# EAGLE schematic traffic_lights_usb (EAGLE 7.4.0)
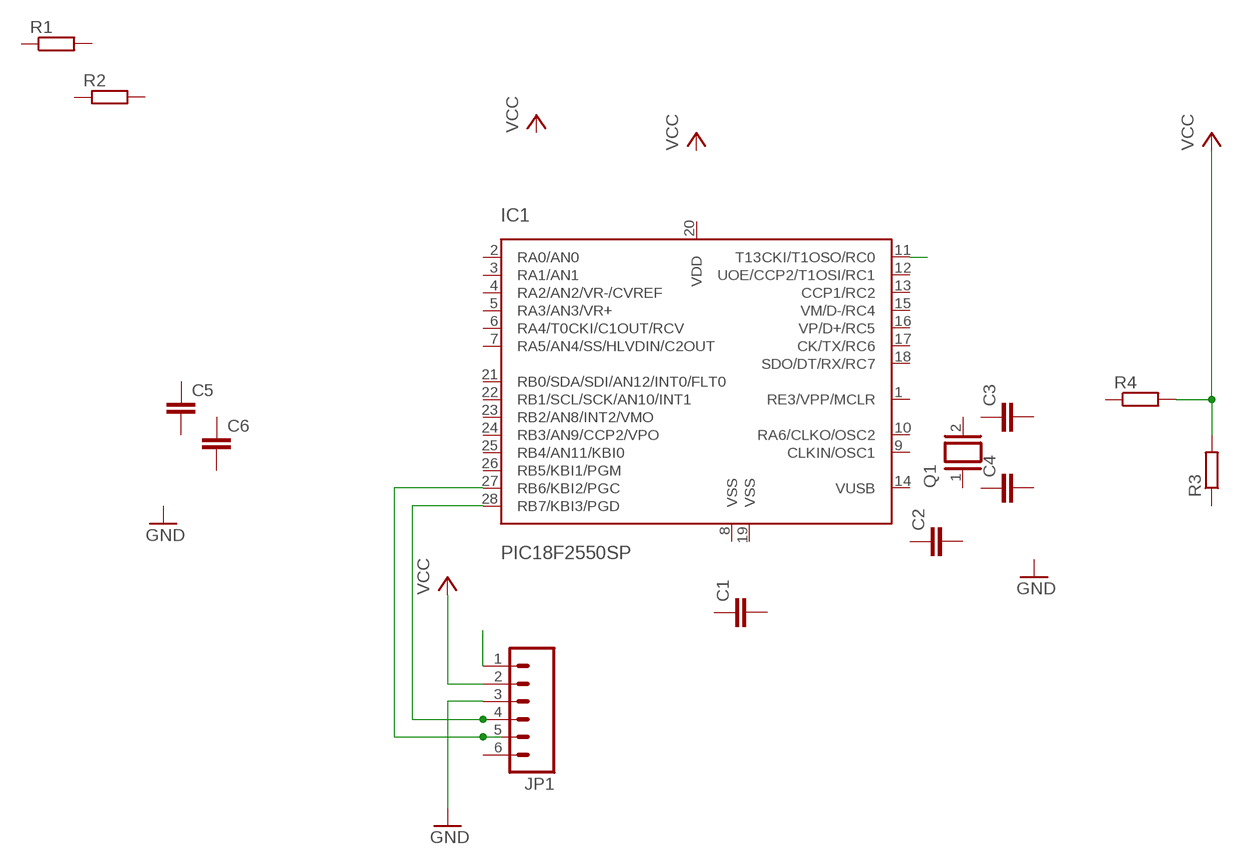
[diagram p0: schematic, sheet 1]

## Parts
C1  C-EU050-024X044  [C050-024X044]
C2  C-EU050-024X044  [C050-024X044]
C3  C-EU050-024X044  [C050-024X044]
C4  C-EU050-024X044  [C050-024X044]
C5  C-EU050-024X044  [C050-024X044]
C6  C-EU050-024X044  [C050-024X044]
IC1  PIC18F2550SP  [DIL28-3]
JP1  M06NO_SILK_FEMALE_PTH  [1X06_NO_SILK]
Q1  XTAL  [Q]
R1  R-EU_0204/7  [0204/7]
R2  R-EU_0204/7  [0204/7]
R3  R-EU_0204/7  [0204/7]
R4  R-EU_0204/7  [0204/7]

## Nets
GND: JP1.3
N$1: IC1.28(RB7/KBI3/PGD) JP1.4
N$2: IC1.27(RB6/KBI2/PGC) JP1.5
N$3: JP1.1
N$9: IC1.11(T13CKI/T1OSO/RC0)
VCC: JP1.2 R3.2 R4.2
Unconnected: C1.1 C1.2 C2.1 C2.2 C3.1 C3.2 C4.1 C4.2 C5.1 C5.2 C6.1 C6.2 IC1.1(RE3/VPP/MCLR) IC1.2(RA0/AN0) IC1.3(RA1/AN1) IC1.4(RA2/AN2/VR-/CVREF) IC1.5(RA3/AN3/VR+) IC1.6(RA4/T0CKI/C1OUT/RCV) IC1.7(RA5/AN4/SS/HLVDIN/C2OUT) IC1.9(CLKIN/OSC1) IC1.10(RA6/CLKO/OSC2) IC1.12(UOE/CCP2/T1OSI/RC1) IC1.13(CCP1/RC2) IC1.15(VM/D-/RC4) IC1.16(VP/D+/RC5) IC1.17(CK/TX/RC6) IC1.18(SDO/DT/RX/RC7) IC1.21(RB0/SDA/SDI/AN12/INT0/FLT0) IC1.22(RB1/SCL/SCK/AN10/INT1) IC1.23(RB2/AN8/INT2/VMO) IC1.24(RB3/AN9/CCP2/VPO) IC1.25(RB4/AN11/KBI0) IC1.26(RB5/KBI1/PGM) JP1.6 Q1.1 Q1.2 R1.1 R1.2 R2.1 R2.2 R3.1 R4.1

## Power pins joined to a net without a drawn wire
VDD: IC1.20(VDD)
VSS: IC1.8(VSS) IC1.19(VSS)
VUSB: IC1.14(VUSB)

## Library data of the parts
C1-C6 = rcl:C-EU: CAPACITOR, European symbol
IC1 = instruction_set:PIC18F2550: PIC18F Flash Microcontroller with USB port
JP1 = SparkFun-Connectors:M06: Header 6 Standard 6-pin 0.1" header. Use with straight break away headers (SKU : PRT-00116), right angle break away headers (PRT-00553), swiss pins (PRT-00743), machine pins (PRT-00117), and female headers (PRT-00115). Molex polarized connector foot print use with SKU : PRT-08094 with associated crimp pins and housings. NOTES ON THE VARIANTS LOCK and LOCK_LONGPADS... This footprint was designed to help hold the alignment of a through-hole component (i.e. 6-pin header) while soldering it into place. You may notice that each hole has been shifted either up or down by 0.005 of an inch from it's more standard position (which is a perfectly straight line). This slight alteration caused the pins (the squares in the middle) to touch the edges of the holes. Because they are alternating, it causes a "brace" to hold the component in place. 0.005 has proven to be the perfect amount of "off-center" position when using our standard breakaway headers. Although looks a little odd when you look at the bare footprint, once you have a header in there, the alteration is very hard to notice. Also,if you push a header all the way into place, it is covered up entirely on the bottom side. This idea of altering the position of holes to aid alignment will be further integrated into the Sparkfun Library for other footprints. It can help hold any component with 3 or more connection pins.; PROD_ID: CONN-08437
Q1 = special:XTAL: CRYSTAL
R1-R4 = resistor:R-EU_: RESISTOR, European symbol